# Altium schematic sheet [04] Power.SchDoc: Power Supplies
size Letter; Revision: 1.0; PageSetup: Record=PageOptions|CenterHorizontal=True|CenterVertical=True|PrintScale=1.00|XCorrection=1.00|YCorrection=1.00|PrintKind=1|BorderSize=5000000|LeftOffset=0|BottomOffset=0|Orientation=2|PaperLength=1000|PaperWidth=1000|Scale=100|PaperSource=7|PrintQuality=-3|MediaType=1|DitherType=10|PrintScaleMode=1|PaperKind=Letter|PaperIndex=1; ProjectTitle: Data Acquisition System
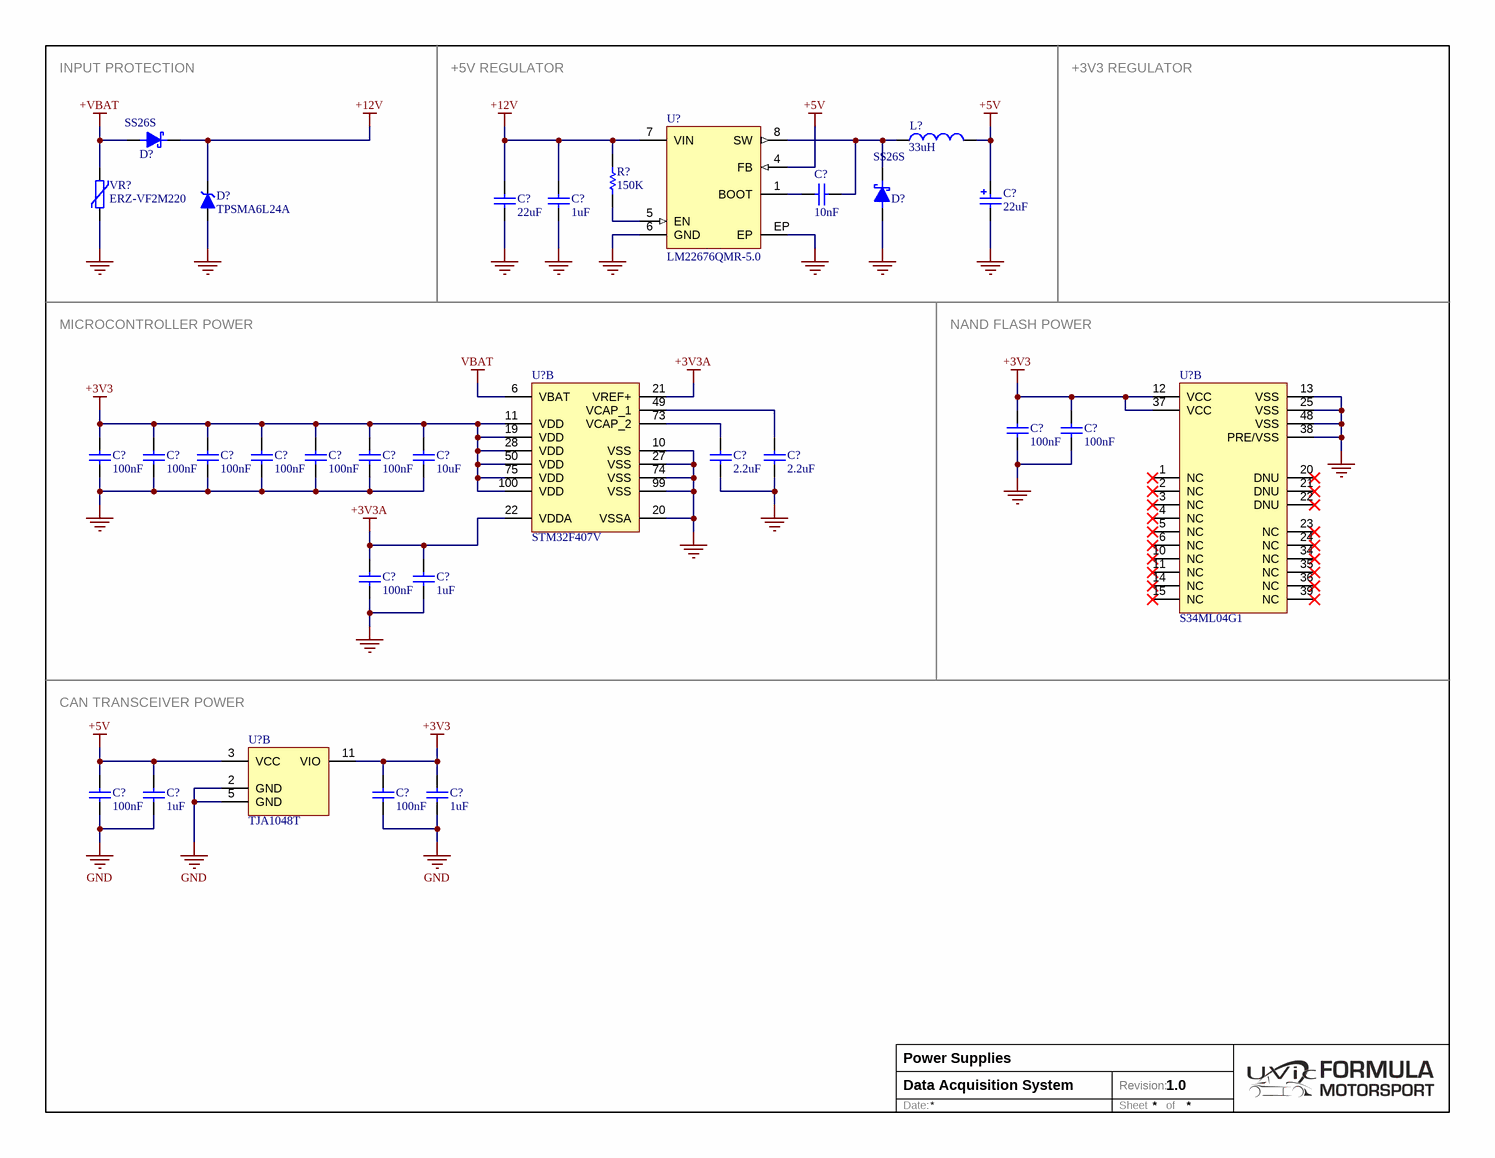
[diagram p0: [04] Power.SchDoc]

## Parts
(Parts that share a designator on the sheet are numbered #1, #2 ... from top to bottom, then left to right.)
C?#1  value 10nF  [CAP-1.6x0.8-0603]  (hidden comment: GRM188R71H103KA01D)
C?#2  value 22uF  [CAP-3.2x2.5-1210]  (hidden comment: GRM32ER71E226KE15L)
C?#3  value 1uF  [CAP-1.6x0.8-0603]  (hidden comment: GRM188R71E105KA12D)
C?#4  value 22uF  [CAP-B1]  (hidden comment: 8TPC22M)
C?#5  value 100nF  [CAP-1.6x0.8-0603]  (hidden comment: GRM188R71C104KA01D)
C?#6  value 100nF  [CAP-1.6x0.8-0603]  (hidden comment: GRM188R71C104KA01D)
C?#7  value 100nF  [CAP-1.6x0.8-0603]  (hidden comment: GRM188R71C104KA01D)
C?#8  value 100nF  [CAP-1.6x0.8-0603]  (hidden comment: GRM188R71C104KA01D)
C?#9  value 100nF  [CAP-1.6x0.8-0603]  (hidden comment: GRM188R71C104KA01D)
C?#10  value 100nF  [CAP-1.6x0.8-0603]  (hidden comment: GRM188R71C104KA01D)
C?#11  value 100nF  [CAP-1.6x0.8-0603]  (hidden comment: GRM188R71C104KA01D)
C?#12  value 100nF  [CAP-1.6x0.8-0603]  (hidden comment: GRM188R71C104KA01D)
C?#13  value 10uF  [CAP-2.0x1.2-0805-1.4mm]  (hidden comment: GRM21BR71A106KA73L)
C?#14  value 2.2uF  [CAP-1.6x0.8-0603]  (hidden comment: GRM188R71A225KE15D)
C?#15  value 2.2uF  [CAP-1.6x0.8-0603]  (hidden comment: GRM188R71A225KE15D)
C?#16  value 100nF  [CAP-1.6x0.8-0603]  (hidden comment: GRM188R71C104KA01D)
C?#17  value 1uF  [CAP-1.6x0.8-0603]  (hidden comment: GRM188R71C105KA12D)
C?#18  value 100nF  [CAP-1.6x0.8-0603]  (hidden comment: GRM188R71C104KA01D)
C?#19  value 1uF  [CAP-1.6x0.8-0603]  (hidden comment: GRM188R71C105KA12D)
C?#20  value 100nF  [CAP-1.6x0.8-0603]  (hidden comment: GRM188R71C104KA01D)
C?#21  value 1uF  [CAP-1.6x0.8-0603]  (hidden comment: GRM188R71C105KA12D)
D?#1  SS26S  [DO-214AC (SMA)]
D?#2  TPSMA6L24A  [SODFL520X110-2N]
D?#3  SS26S  [DO-214AC (SMA)]
L?  value 33uH  [INDP125125X65N]  (hidden comment: SRR1260A-330M)
R?  value 150K  [RES-1.6x0.8-0603]  (hidden comment: RC0603FR-07150KL)
U?#1  LM22676QMR-5.0  [8-SOIC-EP-4.9x3.9mm]
U?#2  STM32F407V  [100-LQFP-14x14-0.5]  (part B of 2)
U?#3  S34ML04G1  [48-TSOP]  (part B of 2)
U?#4  TJA1048T  [SOP127P600X175-14N]  (part B of 2)
VR?  ERZ-VF2M220  [ERZ-VF]

## Nets
+3V3: C?#5.2 C?#6.2 C?#7.2 C?#8.2 C?#9.2 C?#10.2 C?#11.2 C?#12.2 C?#13.2 C?#20.2 C?#21.2 U?#2.11(VDD) U?#2.19(VDD) U?#2.28(VDD) U?#2.50(VDD) U?#2.75(VDD) U?#2.100(VDD) U?#3.12(VCC) U?#3.37(VCC) U?#4.11(VIO)
+3V3A: C?#16.2 C?#17.2 U?#2.21(VREF+) U?#2.22(VDDA)
+5V: C?#4.1 C?#18.2 C?#19.2 L?.2 U?#1.4(FB) U?#4.3(VCC)
+12V: C?#2.2 C?#3.2 D?#1.1(K) D?#2.1(A) R?.2 U?#1.7(VIN)
+VBAT: D?#1.2(A) VR?.2
GND: C?#2.1 C?#3.1 C?#4.2 C?#5.1 C?#6.1 C?#7.1 C?#8.1 C?#9.1 C?#10.1 C?#11.1 C?#12.1 C?#13.1 C?#14.1 C?#15.1 C?#16.1 C?#17.1 C?#18.1 C?#19.1 C?#20.1 C?#21.1 D?#2.2(C) D?#3.2(A) U?#1.6(GND) U?#1.EP U?#2.10(VSS) U?#2.20(VSSA) U?#2.27(VSS) U?#2.74(VSS) U?#2.99(VSS) U?#3.13(VSS) U?#3.25(VSS) U?#3.38(PRE/VSS) U?#3.48(VSS) U?#4.2(GND) U?#4.5(GND) VR?.1
VBAT: U?#2.6(VBAT)
NetC?#1_1: C?#1.1 D?#3.1(K) L?.1 U?#1.8(SW)
NetC?#1_2: C?#1.2 U?#1.1(BOOT)
NetC?#14_2: C?#14.2 U?#2.73(VCAP_2)
NetC?#15_2: C?#15.2 U?#2.49(VCAP_1)
NetR?_1: R?.1 U?#1.5(EN)

Not connected (* = marked no-connect by the designer): U?#1 2(NC) 3(NC); U?#3 1(NC)* 2(NC)* 3(NC)* 4(NC)* 5(NC)* 6(NC)* 10(NC)* 11(NC)* 14(NC)* 15(NC)* 20(DNU)* 21(DNU)* 22(DNU)* 23(NC)* 24(NC)* 34(NC)* 35(NC)* 36(NC)* 39(NC)*

## Notes on the sheet
- INPUT PROTECTION
- +5V REGULATOR
- +3V3 REGULATOR
- MICROCONTROLLER POWER
- NAND FLASH POWER
- CAN TRANSCEIVER POWER
- Date:
- Revision:
- Sheet
- of

## Library data of the parts
C?#1 = GRM188R71H103KA01D: CAP CER 10nF 50V 10% X7R 0603; Supplier 1: Digi-Key; Supplier Part Number 1: 490-1512-1-ND
C?#2 = GRM32ER71E226KE15L: CAP CER 22UF 25V 10% X7R 1210; Supplier 1: Digi-Key; Supplier Part Number 1: 490-5313-1-ND
C?#3 = GRM188R71E105KA12D: CAP CER 1UF 25V 10% X7R 0603; Supplier 1: Digi-Key; Supplier Part Number 1: 490-5307-1-ND
C?#4 = 8TPC22M: CAP TANT 22UF 8V 20% B1; Supplier 1: Digi-Key; Supplier Part Number 1: P16219CT-ND
C?#5-C?#12 C?#16 C?#18 C?#20 = GRM188R71C104KA01D: CAP CER 0.1UF 16V 10% X7R 0603; Supplier 1: Digi-Key; Supplier Part Number 1: 490-1532-1-ND
C?#13 = GRM21BR71A106KA73L: CAP CER 10UF 10V 10% X7R 0805; Supplier 1: Digi-Key; Supplier Part Number 1: 490-10516-1-ND
C?#14 C?#15 = GRM188R71A225KE15D: CAP CER 2.2uF 10V 10% X7R 0603; Supplier 1: Digi-Key; Supplier Part Number 1: 490-4520-1-ND
C?#17 C?#19 C?#21 = GRM188R71C105KA12D: CAP CER 1UF 16V 10% X7R 0603; Supplier 1: Digi-Key; Supplier Part Number 1: 490-3900-1-ND
D?#1 D?#3 = SS26S: SMD Schottky Diode; Supplier 1: Digi-Key; Supplier Part Number 1: 475-1278-1-ND
D?#2 = TPSMA6L24A: SMD TVS Diode; Supplier 1: Digi-Key; Supplier Part Number 1: F6148CT-ND
L? = SRR1260A-330M: SRR1260 Shield SMD Power Inductor; Supplier 1: Digi-Key; Supplier Part Number 1: SRR1260A-330MCT-ND
R? = RC0603FR-07150KL: RES 0.1W 150K 1% 0603; Supplier 1: Digi-Key; Supplier Part Number 1: 311-150KHRCT-ND
U?#2 = STM32F407V: STM32F407 100-LQFP; Supplier 1: Digi-Key; Supplier Part Number 1: 497-11605-ND
U?#4 = TJA1048T: Dual CAN transceiver; Supplier 1: Digi-Key; Supplier Part Number 1: 568-8681-1-ND
VR? = ERZ-VF2M220: SMD Varistor 22V; Supplier 1: Digi-Key; Supplier Part Number 1: P7345CT-ND
U?#1 = LM22676QMR-5.0: Supplier 1: Digi-Key; Supplier Part Number 1: LM22676QMR-5.0/NOPB-ND